# EAGLE design ewod-1x4 (EAGLE 6.3)

## Sheet 1 of 3
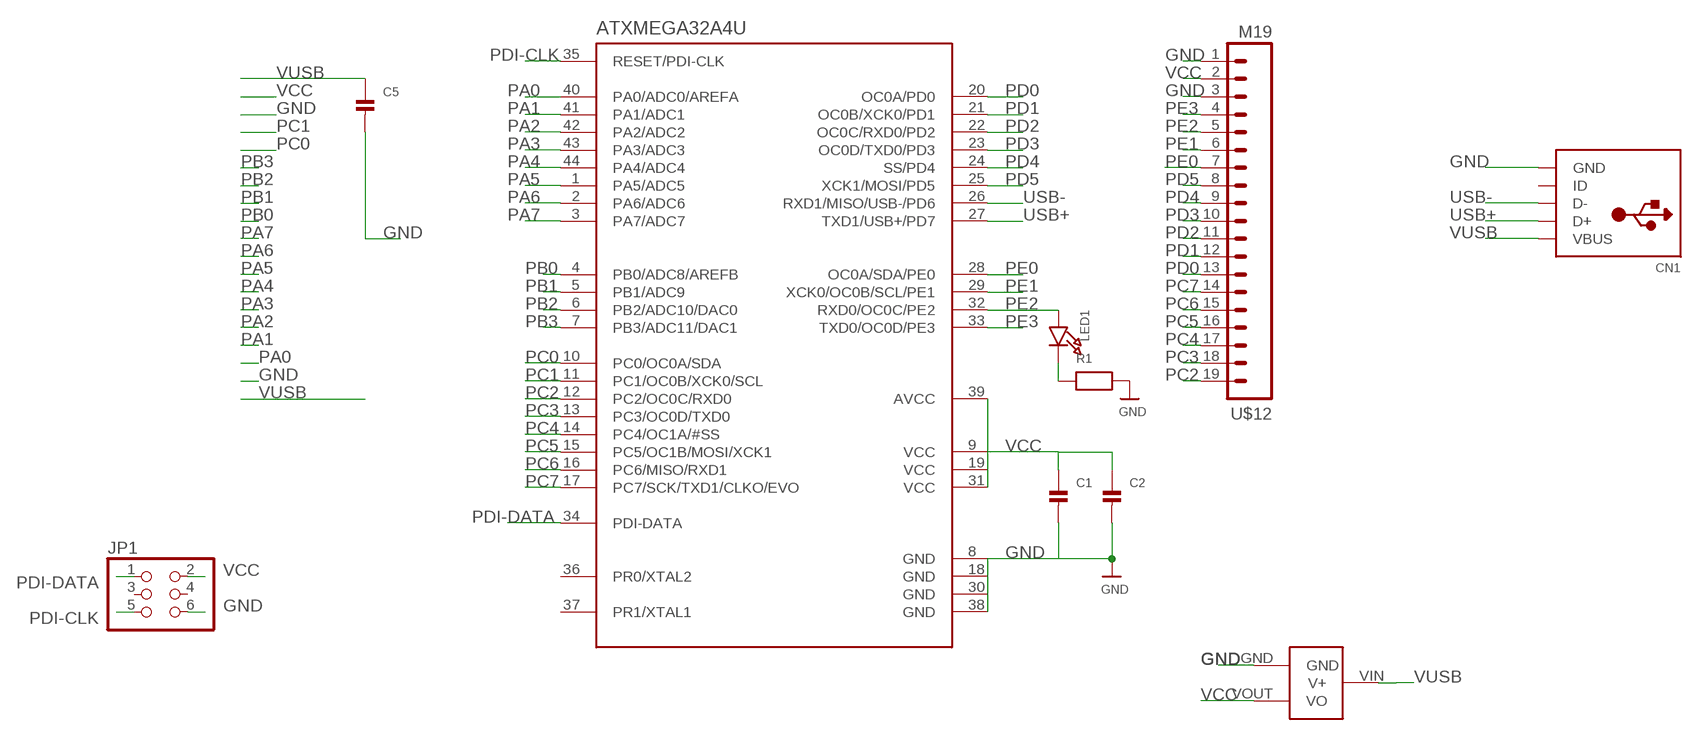
[diagram p0: schematic, sheet 1]

### Parts
ATXMEGA32A4U  ATXMEGAXXA4U-AU  [TQFP-44]
C1  CAP_CERAMIC0603  [0603]
C2  CAP_CERAMIC0603  [0603]
C5  CAP_CERAMIC0603  [0603]
CN1  USBMICROB  [USB-MICROB]
JP1  HEADER-2X3  [2X03]
LED1  LED0603  [CHIPLED_0603]
R1  RESISTOR0603  [0603]
U$10  MCP1700  [SOT23-3]
U$12  M19  [1X19]

### Nets
GND: ATXMEGA32A4U.8(GND) ATXMEGA32A4U.18(GND) ATXMEGA32A4U.30(GND) ATXMEGA32A4U.38(GND) C1.2 C2.2 C5.2 CN1.P5(GND) JP1.6 R1.2 U$10.GND U$12.1 U$12.3 ; also sheet 2,3
N$1: LED1.C R1.1
PA0: ATXMEGA32A4U.40(PA0/ADC0/AREFA) ; also sheet 2
PA1: ATXMEGA32A4U.41(PA1/ADC1) ; also sheet 2
PA2: ATXMEGA32A4U.42(PA2/ADC2) ; also sheet 2
PA3: ATXMEGA32A4U.43(PA3/ADC3) ; also sheet 2
PA4: ATXMEGA32A4U.44(PA4/ADC4)
PA5: ATXMEGA32A4U.1(PA5/ADC5)
PA6: ATXMEGA32A4U.2(PA6/ADC6)
PA7: ATXMEGA32A4U.3(PA7/ADC7)
PB0: ATXMEGA32A4U.4(PB0/ADC8/AREFB)
PB1: ATXMEGA32A4U.5(PB1/ADC9)
PB2: ATXMEGA32A4U.6(PB2/ADC10/DAC0)
PB3: ATXMEGA32A4U.7(PB3/ADC11/DAC1)
PC0: ATXMEGA32A4U.10(PC0/OC0A/SDA)
PC1: ATXMEGA32A4U.11(PC1/OC0B/XCK0/SCL)
PC2: ATXMEGA32A4U.12(PC2/OC0C/RXD0) U$12.19
PC3: ATXMEGA32A4U.13(PC3/OC0D/TXD0) U$12.18
PC4: ATXMEGA32A4U.14(PC4/OC1A/#SS) U$12.17 ; also sheet 2
PC5: ATXMEGA32A4U.15(PC5/OC1B/MOSI/XCK1) U$12.16 ; also sheet 2
PC6: ATXMEGA32A4U.16(PC6/MISO/RXD1) U$12.15 ; also sheet 2
PC7: ATXMEGA32A4U.17(PC7/SCK/TXD1/CLKO/EVO) U$12.14 ; also sheet 2
PD0: ATXMEGA32A4U.20(OC0A/PD0) U$12.13
PD1: ATXMEGA32A4U.21(OC0B/XCK0/PD1) U$12.12
PD2: ATXMEGA32A4U.22(OC0C/RXD0/PD2) U$12.11
PD3: ATXMEGA32A4U.23(OC0D/TXD0/PD3) U$12.10
PD4: ATXMEGA32A4U.24(SS/PD4) U$12.9
PD5: ATXMEGA32A4U.25(XCK1/MOSI/PD5) U$12.8
PDI-CLK: ATXMEGA32A4U.35(RESET/PDI-CLK) JP1.5
PDI-DATA: ATXMEGA32A4U.34(PDI-DATA) JP1.1
PE0: ATXMEGA32A4U.28(OC0A/SDA/PE0) U$12.7
PE1: ATXMEGA32A4U.29(XCK0/OC0B/SCL/PE1) U$12.6
PE2: ATXMEGA32A4U.32(RXD0/OC0C/PE2) LED1.A U$12.5
PE3: ATXMEGA32A4U.33(TXD0/OC0D/PE3) U$12.4
USB+: ATXMEGA32A4U.27(TXD1/USB+/PD7) CN1.P3(D+)
USB-: ATXMEGA32A4U.26(RXD1/MISO/USB-/PD6) CN1.P2(D-)
VCC: ATXMEGA32A4U.9(VCC) ATXMEGA32A4U.19(VCC) ATXMEGA32A4U.31(VCC) ATXMEGA32A4U.39(AVCC) C1.1 C2.1 JP1.2 U$10.VOUT(VO) U$12.2
VUSB: C5.1 CN1.P1(VBUS) U$10.VIN(V+)
Unconnected: ATXMEGA32A4U.36(PR0/XTAL2) ATXMEGA32A4U.37(PR1/XTAL1) CN1.P4(ID) JP1.3 JP1.4

## Sheet 2 of 3
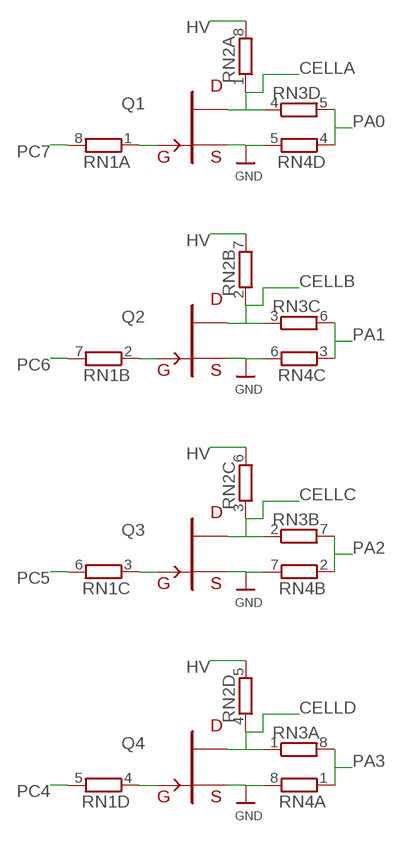
[diagram p1: schematic, sheet 2]

### Parts
Q1  FET-N  [SOT23]
Q2  FET-N  [SOT23]
Q3  FET-N  [SOT23]
Q4  FET-N  [SOT23]
RN1  RNETWORK  [RN8P-4R-CRA06S]
RN2  RNETWORK  [RN8P-4R-CRA06S]
RN3  RNETWORK  [RN8P-4R-CRA06S]
RN4  RNETWORK  [RN8P-4R-CRA06S]

### Nets
CELLA: Q1.3(D) RN2.1 RN3.4
CELLB: Q2.3(D) RN2.2 RN3.3
CELLC: Q3.3(D) RN2.3 RN3.2
CELLD: Q4.3(D) RN2.4 RN3.1
GATEA: Q1.1(G) RN1.1
GATEB: Q2.1(G) RN1.2
GATEC: Q3.1(G) RN1.3
GATED: Q4.1(G) RN1.4
GND: Q1.2(S) Q2.2(S) Q3.2(S) Q4.2(S) RN4.5 RN4.6 RN4.7 RN4.8 ; also sheet 1,3
HV: RN2.5 RN2.6 RN2.7 RN2.8 ; also sheet 3
PA0: RN3.5 RN4.4 ; also sheet 1
PA1: RN3.6 RN4.3 ; also sheet 1
PA2: RN3.7 RN4.2 ; also sheet 1
PA3: RN3.8 RN4.1 ; also sheet 1
PC4: RN1.5 ; also sheet 1
PC5: RN1.6 ; also sheet 1
PC6: RN1.7 ; also sheet 1
PC7: RN1.8 ; also sheet 1

## Sheet 3 of 3
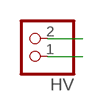
[diagram p2: schematic, sheet 3]

### Parts
HV  HEADER-1X2ROUND  [1X02_ROUND]

### Nets
GND: HV.2 ; also sheet 1,2
HV: HV.1 ; also sheet 2

## Library data of the parts
ATXMEGA32A4U = nonolith:ATXMEGAXXA4U: ATXMEGA A4U Series (XMEGA+USB)
C1 C2 C5 = nonolith:CAP_CERAMIC: Ceramic Capacitors 0402 - 0402 Surface Mount Capacitors 0.1uF 10V 10% [Digikey: 490-1318-2-ND] 0603 - 0603 Surface Mount Capacitors 16 pF 50V 5% [Digikey: 445-5051-2-ND] 22 pF 50V [Digikey: PCC220ACVTR-ND] 33 pF 50V 5% [Digikey: 490-1415-1-ND] 56pF 50V 5% [Digikey: 490-1421-1-ND] 220pF 50V 5% [Digikey: 445-1285-1-ND] 680 pF 50V 2200 pF 50V 5% C0G [Digikey: 445-1297-1-ND] 5600 pF 100V 5% X7R [Digikey: 478-3711-1-ND] 0.1 µF 25V 10% [Digikey: PCC2277TR-ND] 0.22 µF 16V 10% X7R [Digikey: 445-1318-1-ND] 1.0 µF 25V 10% [Digikey: 445-5146-2-ND] 0603 - RF Specific 3pF 250V +/-0.1pF RF [Digikey: 712-1347-1-ND] 18 pF 250V 5% [Digikey: 478-3505-1-ND or 712-1322-1-ND] 56 pF 250V 5% C0G RF [Digikey: 490-4867-1-ND] 68 pF 250V RF [Digikey: 490-4868-1-ND] 0805 - 0805 Surface Mount Capacitors 220 pF 250V 2% RF Ceramic Capacitor [Digikey: 712-1398-1-ND] 1000 pF 50V 2% NP0 Ceramic Capacitor [Digikey: 478-3760-1-ND] 0.1 µF 25V 10% Ceramic Capacitor [Digikey: PCC1828TR-ND] 1.0 µF 16V 10% Ceramic Capacitor[Digikey: 490-1691-2-ND] 10.0 µF 10V 10% Ceramic Capacitor[Digikey: 709-1228-1-ND] 1206 - 1206 Surface Mount Capacitors
CN1 = nonolith:USB: USB Connectors USBMINIB - Surface Mount Female Mini-B USB Connector 4UConnector: 06564 By microbuilder.eu
HV = nonolith:HEADER-1X2: PIN HEADER
JP1 = nonolith:HEADER-2X3: PIN HEADER
LED1 = microbuilder:LED: LED 0603 - 0603 Surface Mount Package 2mA: Green LED - Low Power (3.9mcd, 2ma, 1.7Vf) - Digikey: 475-2709-2-ND Orange LED - Low Power (9.8mcd, 2ma, 1.8Vf) - Digikey: 475-1194-2-ND Red LED - Low Power (5mcd, 2ma, 1.8Vf) - Digikey: 475-1195-2-ND Yellow LED - Low Power (7mcd, 2ma, 1.8Vf) - Digikey: 475-1196-2-ND 5mA: Blue LED - Low Power (17mcd, 5ma, 2.9Vf) - Digikey: LNJ937W8CRACT-ND 0805 - 0805 Surface Mount Package 2mA: Red LED (8.8mcd, 2mA, 1.8Vf, Clear) - Low Power [Digikey: 475-2510-1-ND] Green LED (5mcd, 2mA, 1.8Vf, Clear) - Low Power [Digikey: 475-2730-1-ND] Yellow LED (11.3mcd, 2mA, 1.8Vf, Clear) - Low Power [Digikey: 475-2555-1-ND] 20mA: Red LED (104mcd, 20mA, Diffused) - LS R976 [Digikey: 475-1278-6-ND] Red LED (12mcd, 20mA, 2.0Vf, Clear) - APT2012EC [Digikey: 754-1128-1-ND] Green LED (15mcd, 20mA, 2.2Vf, Clear) - APT2012GC [Digikey: 754-1131-1-ND] Orange LED (160mcd, 20mA, 2.1Vf, Clear) - APT2012SECK [Digikey: 754-1130-1-ND] 1206 - 1206 Surface Mount Package Green LED (26mcd, 20mA, Diffused) - LG N971 [Digikey: 475-1407-6-ND] Red LED (15mcd, 20mA, Diffused) - LH N974 [Digikey: 475-1416-6-ND]
Q1-Q4 = dp_devices:FET-N
R1 = nonolith:RESISTOR: Resistors 0402 - 0402 Surface Mount Package 10.0K 1% 1/16W [Digikey: 311-10.0KLRTR-ND] 0603 - 0603 Surface Mount Package 0 Ohm 1/10 Watt 1% Resistor 15 Ohm 1/10 Watt 1% Resistor 33 Ohm 1/10 Watt 1% Resistor 49.9 Ohm 1/10 Watt 1% Resistor 100 Ohm 1/10 Watt 1% Resistor 150 Ohm 1/10 Watt 1% Resistor 240 Ohm 1/10 Watt 1% Resistor 390 Ohm 1/10 Watt 1% Resistor 560 Ohm 1/10 Watt 1% Resistor 750 Ohm 1/10 Watt 1% Resistor 1.0K Ohm 1/10 Watt 1% Resistor 1.5K Ohm 1/10 Watt 1% Resistor 2.0K Ohm 1/10 Watt 1% Resistor 4.7K Ohm 1/10 Watt 1% Resistor 10.0K Ohm 1/10 Watt 1% Resistor 20.0K Ohm 1/10 Watt 1% Resistor 33.0K Ohm 1/10 Watt 1% Resistor 100.0K Ohm 1/10 Watt 1% Resistor 0805 - 0805 Surface Mount Package 0 Ohm 1/8 Watt 1% Resistor 33 Ohm 1/8 Watt 1% Resistor 100 Ohm 1/8 Watt 1% Resistor 150 Ohm 1/8 Watt 1% Resistor 200 Ohm 1/8 Watt 1% Resistor 240 Ohm 1/8 Watt 1% Resistor 330 Ohm 1/8 Watt 1% Resistor 390 Ohm 1/8 Watt 1% Resistor 470 Ohm 1/8 Watt 1% Resistor 1.0K Ohm 1/8 Watt 1% Resistor 1.5K Ohm 1/8 Watt 1% Resistor 2.0K Ohm 1/8 Watt 1% Resistor 4.7K Ohm 1/8 Watt 1% Resistor 5.1K Ohm 1/8 Watt 1% Resistor 5.6K Ohm 1/8 Watt 1% Resistor 10.0K Ohm 1/8 Watt 1% Resistor 22.0K Ohm 1/8 Watt 1% Resistor 33.0K Ohm 1/8 Watt 1% Resistor 100K Ohm 1/8 Watt 1% Resistor 1206 - 1206 Surface Mount Package
RN1-RN4 = nonolith:RNETWORK: 4 Resistor Array 0603
U$10 = nonolith:MCP1700: Voltage regulator
U$12 = SparkFun:M19

## Net classes
0 default: width 0.203 mm, clearance 0.152 mm

## Board
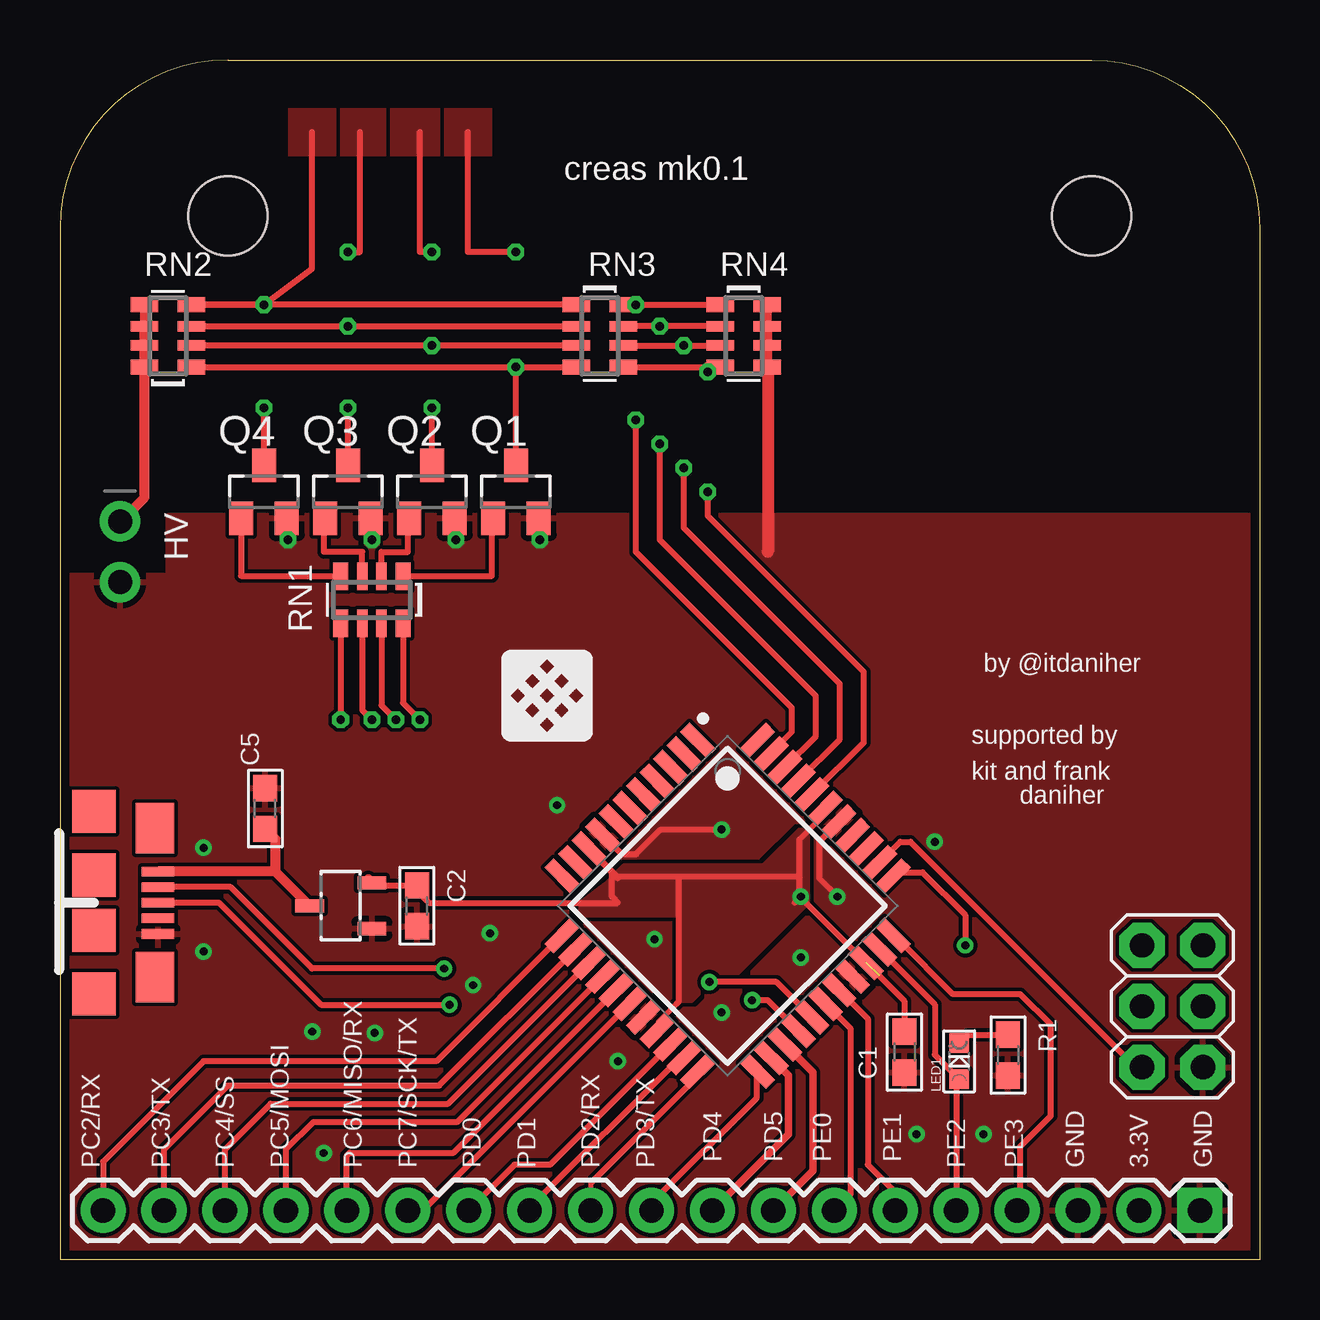
[diagram p3: board, top side]
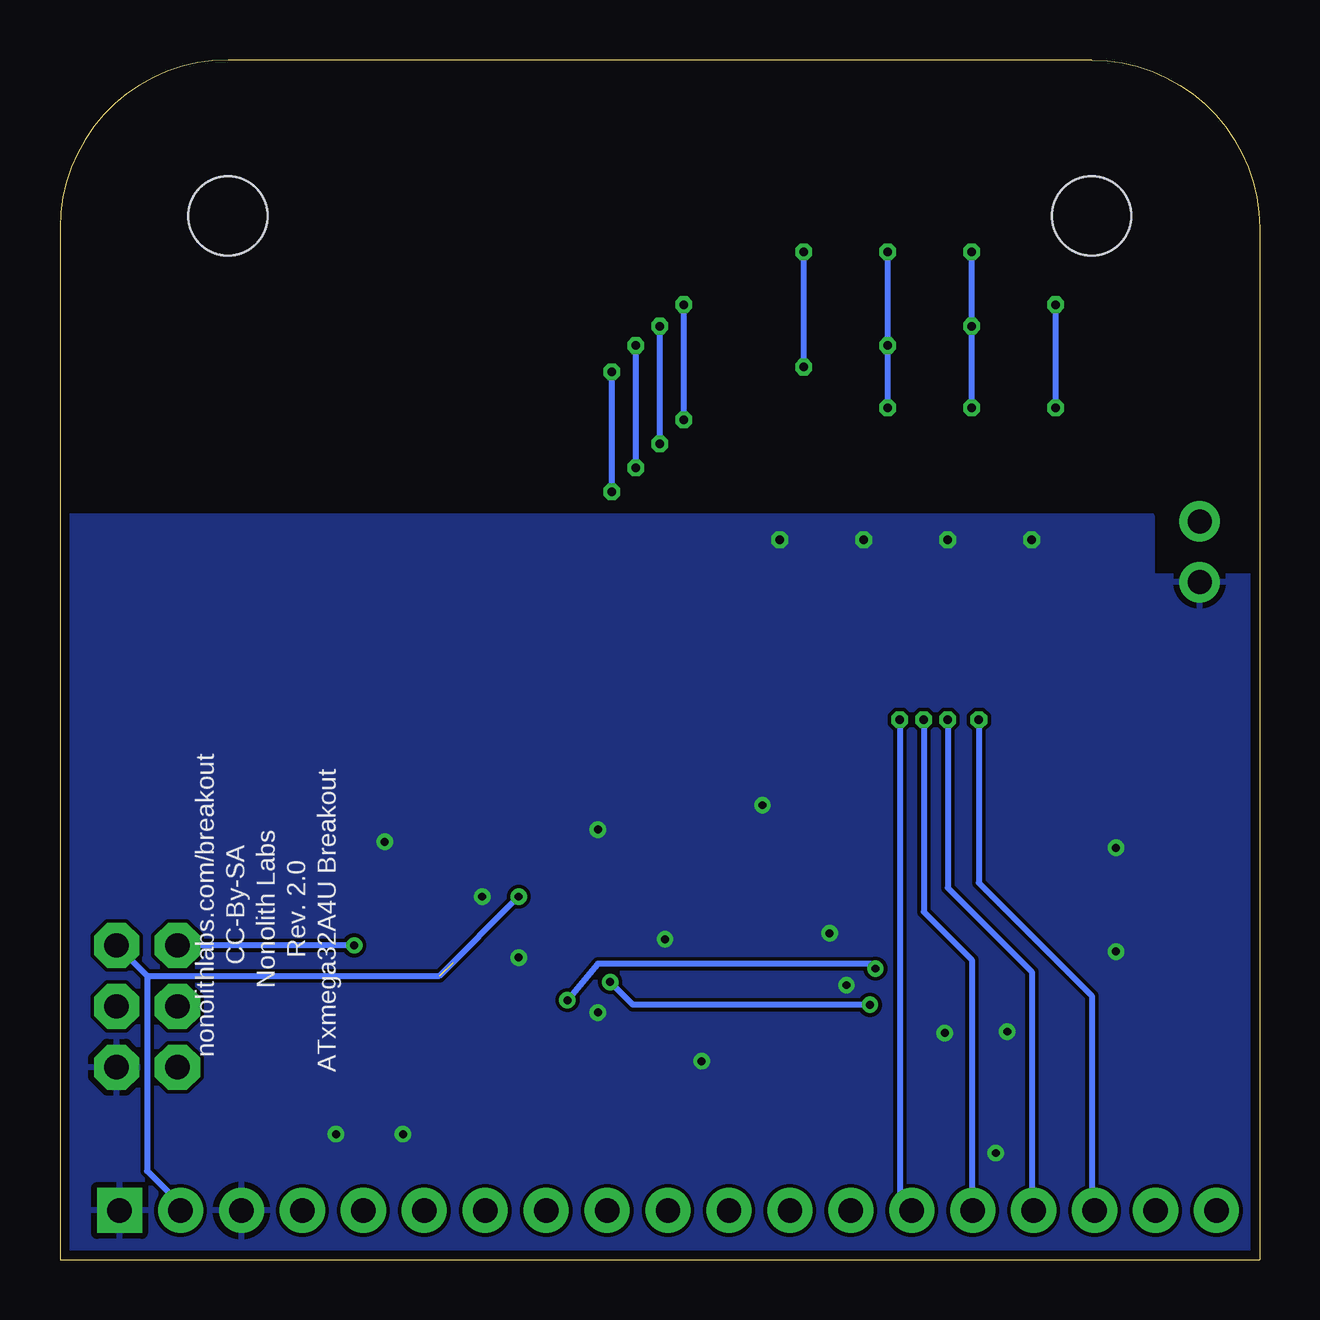
[diagram p4: board, bottom side, seen from below]

Size 50 x 50 mm. Coordinates in mm from the lower left corner, seen from the top.
Outline: 7,50 43,50 arc-90 50,43 50,0 0,0 0,43 arc-90 7,50
Copper layers (1*16): Top 0.0356mm / dielectric 1.5011mm / Bottom 0.0356mm
Design rules "LaenPCBOrder *": minimum track width 6mil, minimum drill 13mil, track to track 6mil, track to pad 6mil, pad to pad 6mil, via to via 6mil, smd to smd 6mil, copper to edge 15mil, drill to drill 6mil, minimum pad ring 7mil, minimum via ring 7mil, stop-mask expansion 0mil, vias tented up to drill 100mil, thermal gap 10mil
vRestrict: area 9,46 to 18.5,48.5

### Footprints (pad centres in the part's own frame; a part is rotated, then mirrored left to right if it is on the bottom)
TQFP-44 = smd 1.55 x 0.55: 1 -5.75,4; 2 -5.75,3.2; 3 -5.75,2.4; 4 -5.75,1.6; 5 -5.75,0.8; 6 -5.75,0; 7 -5.75,-0.8; 8 -5.75,-1.6; 9 -5.75,-2.4; 10 -5.75,-3.2; 11 -5.75,-4; 23 5.75,-4; 24 5.75,-3.2; 25 5.75,-2.4; 26 5.75,-1.6; 27 5.75,-0.8; 28 5.75,0; 29 5.75,0.8; 30 5.75,1.6; 31 5.75,2.4; 32 5.75,3.2; 33 5.75,4 | smd 0.55 x 1.55: 12 -4,-5.75; 13 -3.2,-5.75; 14 -2.4,-5.75; 15 -1.6,-5.75; 16 -0.8,-5.75; 17 0,-5.75; 18 0.8,-5.75; 19 1.6,-5.75; 20 2.4,-5.75; 21 3.2,-5.75; 22 4,-5.75; 34 4,5.75; 35 3.2,5.75; 36 2.4,5.75; 37 1.6,5.75; 38 0.8,5.75; 39 0,5.75; 40 -0.8,5.75; 41 -1.6,5.75; 42 -2.4,5.75; 43 -3.2,5.75; 44 -4,5.75
0603 = smd 1.1 x 1: 1 -0.85,0; 2 0.85,0
USB-MICROB = smd 0.4 x 1.35: P1 -1.3,2.675; P2 -0.65,2.675; P3 0,2.675; P4 0.65,2.675; P5 1.3,2.675 | smd 1.8 x 1.8: PAD-LB -1.15,0; PAD-LLB -3.8,0; PAD-RB 1.15,0; PAD-RRB 3.8,0 | smd 2.1 x 1.6: PAD-LT -3.1,2.55; PAD-RT 3.1,2.55
1X02_ROUND = drill 1 pad 1.676: 1 -1.27,0; 2 1.27,0
2X03 = drill 1.016 pad 1.88 octagon: 1 -2.54,-1.27; 2 -2.54,1.27; 3 0,-1.27; 4 0,1.27; 5 2.54,-1.27; 6 2.54,1.27
CHIPLED_0603 = smd 0.8 x 0.8: A 0,-0.75; C 0,0.75
SOT23 = smd 1 x 1.4: 1 -0.95,-1.1; 2 0.95,-1.1; 3 0,1.1
RN8P-4R-CRA06S = smd 0.63 x 1.15: 1 -1.295,-0.975; 4 1.295,-0.975; 5 1.295,0.975; 8 -1.295,0.975 | smd 0.44 x 1.15: 2 -0.4,-0.975; 3 0.4,-0.975; 6 0.4,0.975; 7 -0.4,0.975
STAND-OFF = hole 3.302: 0,0
SOT23-3 = smd 0.55 x 1.2: GND 0.95,1.3; VIN 0,-1.3; VOUT -0.95,1.3
1X19 = drill 1.016 pad 1.88 square: 1 0,0 | drill 1.016 pad 1.88: 2 2.54,0; 3 5.08,0; 4 7.62,0; 5 10.16,0; 6 12.7,0; 7 15.24,0; 8 17.78,0; 9 20.32,0; 10 22.86,0; 11 25.4,0; 12 27.94,0; 13 30.48,0; 14 33.02,0; 15 35.56,0; 16 38.1,0; 17 40.64,0; 18 43.18,0; 19 45.72,0

### Placement (x,y rotation side)
ATXMEGA32A4U  27.83,14.74 315 top
C1  35.2,8.65 270 top
C2  14.88,14.74 270 top
C5  8.56,18.8 90 top
CN1  1.41,14.87 270 top
HV  2.5,29.5 270 top
JP1  46.37,10.55 270 top
LED1  37.48,8.27 0 top
Q1  19,32 0 top
Q2  15.5,32 0 top
Q3  12,32 0 top
Q4  8.5,32 0 top
R1  39.51,8.52 270 top
RN1  13,27.5 180 top
RN2  4.5,38.5 90 top
RN3  22.5,38.5 270 top
RN4  28.5,38.5 270 top
U$1  [STAND-OFF]  7,43.5 0 top
U$2  [STAND-OFF]  43,43.5 0 top
U$5  [LOGO_NONOLITH]  18.4,21.6 0 top
U$10  11.7,14.74 270 top
U$12  47.52,2.04 180 top

### Tracks (layer width: path | path; a pad name or v marks a point on that pad's centre or on a via)
CELLA  (via drill 0.35)
  Top 0.254: RN2.1 v19,37.2 | v19,37.2 RN3.4 | Q1.3 v19,37.2 | v19,42 17,42 17,47
  Bottom 0.254: v19,37.2 v19,42
  pour Top (isolate 0.152, no thermals): 16,48 18,48 18,46 16,46
CELLB  (via drill 0.35)
  Top 0.254: RN3.3 v15.5,38.1 RN2.2 | Q2.3 v15.5,35.5 | v15.5,42 15,42 15,47
  Bottom 0.254: v15.5,35.5 v15.5,38.1 v15.5,42
  pour Top (isolate 0.152, rank 2, no thermals): 13.75,48 16,48 16,46 13.75,46
CELLC  (via drill 0.35)
  Top 0.254: RN2.3 v12,38.9 RN3.2 | Q3.3 v12,35.5 | v12,42 12.5,42 12.5,47
  Bottom 0.254: v12,35.5 v12,38.9 v12,42
  pour Top (isolate 0.152, rank 3, no thermals): 11.5,48 13.75,48 13.75,46 11.5,46
CELLD  (via drill 0.35)
  Top 0.254: RN3.1 RN2.4 v8.5,39.8 10.5,41.3 10.5,47 | Q4.3 v8.5,35.5
  Bottom 0.254: v8.5,35.5 v8.5,39.8
  pour Top (isolate 0.152, no thermals): 9.5,48 11.5,48 11.5,46 9.5,46
GATEA
  Top 0.254: 14.29,28.5 18,28.5 18,30.9
  Top 0.406: RN1.1 14.29,28.5 | 18,30.9 Q1.1
GATEB
  Top 0.254: RN1.2 13.4,29.5 14.5,29.5 14.5,30.9
  Top 0.406: 14.5,30.9 Q2.1
GATEC
  Top 0.254: RN1.3 12.6,29.5 11,29.5 11,30.9
  Top 0.406: 11,30.9 Q3.1
GATED
  Top 0.254: Q4.1 7.55,28.5 11.71,28.5
  Top 0.406: RN1.4 11.71,28.5
GND  (via drill 0.33, 0.35)
  Top 0.254: ATXMEGA32A4U.8 23.41,16.9 24.02,16.9 25.04,17.92 v27.58,17.92 | 32.4,18.17 31.64,17.41 31.64,15.89 v32.4,15.13
  Top 0.406: RN4.8 RN4.7 RN4.6 RN4.5
  Top 0.508: RN4.5 29.5,37.18 29.5,29.5
  other vias: 9.5,30 20,30 10.51,9.5 30.88,12.59 13.12,9.44 5.99,12.84 23.26,8.27 27.58,10.3 38.5,5.22 5.99,17.16 36.47,17.41 11,4.44 20.72,18.94 24.78,13.35 17.92,13.6 35.7,5.22 17.22,11.44 16.5,30 13,30
  pour Top (rank 6): -1,-0.5 52,-0.5 50,31 4.5,31 4.5,28.5 0,28.5
  pour Bottom: -4,-2 50,0.5 51,31 4.5,31 4.5,28.5 -4.5,28.5
HV
  Top 0.254: RN2.6 RN2.7 RN2.8
  Top 0.406: RN2.5 RN2.6 3.52,31.77 HV.1
N$1
  Top 0.254: LED1.C 37.84,9.37 R1.1
PA0  (via drill 0.35)
  Top 0.254: RN3.5 27,37.2 RN4.4 27.52,37.23 27.5,37.25 27.5,37 | ATXMEGA32A4U.40 33.5,21.55 33.5,24.5 27,31 v27,32
  Top 0.406: v27,37 27,37.2
  Bottom 0.254: v27,32 v27,37
PA1  (via drill 0.35)
  Top 0.254: RN3.6 v26,38.1 RN4.3 | ATXMEGA32A4U.41 32.5,21.68 32.5,24 26,30.5 v26,33
  Bottom 0.254: v26,33 v26,38.1
PA2  (via drill 0.35)
  Top 0.254: RN4.2 v25,38.9 RN3.7 | ATXMEGA32A4U.42 31.5,21.81 31.5,23.5 25,30 v25,34
  Bottom 0.254: v25,34 v25,38.9
PA3  (via drill 0.35)
  Top 0.254: RN3.8 v24,39.8 RN4.1 | ATXMEGA32A4U.43 29.63,21.13 30.5,22 30.5,23 24,29.5 v24,35
  Bottom 0.254: v24,35 v24,39.8
PC2
  Top 0.254: ATXMEGA32A4U.12 15.7,8.27 5.99,8.27 1.79,4.08 U$12.19
PC3
  Top 0.254: U$12.18 4.33,4.58 7,7.25 15.81,7.25 ATXMEGA32A4U.13
PC4  (via drill 0.35)
  Top 0.254: U$12.17 6.88,4.58 8.78,6.49 16.18,6.49 ATXMEGA32A4U.14 | RN1.5 v11.7,22.5
  Bottom 0.254: v11.7,22.5 11.7,15.7 7,11 7,2.17 U$12.17
PC5  (via drill 0.35)
  Top 0.254: ATXMEGA32A4U.15 16.55,5.73 10.56,5.73 9.41,4.58 U$12.16 | RN1.6 12.6,22.9 v13,22.5
  Bottom 0.254: v13,22.5 13,15.5 9.5,12 9.5,2.13 U$12.16
PC6  (via drill 0.35)
  Top 0.254: U$12.15 11.96,4.33 12.08,4.46 16.41,4.46 ATXMEGA32A4U.16 | RN1.7 13.4,23.1 v14,22.5
  Bottom 0.254: v14,22.5 14,14.5 12,12.5 12,2.09 U$12.15
PC7  (via drill 0.35)
  Top 0.254: ATXMEGA32A4U.17 15.13,2.04 U$12.14 | RN1.8 14.29,23.2 v15,22.5
  Bottom 0.254: v15,22.5 15,2.55 U$12.14
PD0
  Top 0.254: ATXMEGA32A4U.20 20.43,3.95 18.94,3.95 U$12.13
PD1
  Top 0.203: 25.8,8.37 26,8.37 ATXMEGA32A4U.21 | 19.6,2.17 19.6,2.07 U$12.12
  Top 0.254: 19.6,2.17 25.8,8.37
PD2
  Top 0.203: 26.56,7.61 26.56,7.81 ATXMEGA32A4U.22 | 22.14,3.19 22.14,2.07 U$12.11
  Top 0.254: 22.14,3.19 26.56,7.61
PD3
  Top 0.203: 24.68,2.38 24.68,2.07 U$12.10 | 29.05,7.81 ATXMEGA32A4U.23
  Top 0.254: 29.05,7.81 29.05,6.74 24.68,2.38
PD4
  Top 0.305: ATXMEGA32A4U.24 30.37,7.68 30.37,5.22 U$12.9
PD5
  Top 0.305: U$12.8 31.39,3.7 31.39,7.79 ATXMEGA32A4U.25
PDI-CLK
  Top 0.254: ATXMEGA32A4U.35 35.02,17.41 35.45,17.41 44.85,8.01 JP1.5
PDI-DATA  (via drill 0.33)
  Top 0.254: ATXMEGA32A4U.34 34.88,16.14 35.96,16.14 37.74,14.36 v37.74,13.09
  Bottom 0.254: v37.74,13.09 JP1.1
PE0
  Top 0.203: 31.95,10.66 ATXMEGA32A4U.28
  Top 0.254: U$12.7 32.96,2.73 32.96,9.61 ATXMEGA32A4U.28
PE1
  Top 0.254: ATXMEGA32A4U.29 33.67,10.03 33.67,3.95 34.81,2.81 U$12.6
PE2
  Top 0.254: ATXMEGA32A4U.32 36.47,10.63 36.47,8.53 LED1.A 37.35,7.64 U$12.5
PE3
  Top 0.254: U$12.4 40.02,2.17 40.02,4.71 41.29,5.98 41.29,9.79 40.02,11.06 37.23,11.06 34.94,13.35 34.69,13.35 34.72,13.38 ATXMEGA32A4U.33 34.78,13.51
USB+  (via drill 0.33)
  Top 0.254: ATXMEGA32A4U.27 29.87,11.57 v27.07,11.57 | CN1.P3 6.63,14.87 10.88,10.62 v16.24,10.62
  Bottom 0.254: v16.24,10.62 26.12,10.62 v27.07,11.57
USB-  (via drill 0.33)
  Top 0.254: ATXMEGA32A4U.26 29.5,10.81 v28.85,10.81 | CN1.P2 7.11,15.52 10.51,12.13 v16.01,12.13
  Bottom 0.254: v28.85,10.81 27.58,12.33 16.22,12.33 v16.01,12.13
VCC  (via drill 0.33)  (1 unrouted)
  Top 0.203: 30.83,17.51 31.89,18.58 31.89,18.78 ATXMEGA32A4U.39 | 14.62,15.63 14.57,15.69 | 25.7,10.66 24.93,9.89 24.93,9.59 ATXMEGA32A4U.19
  Top 0.254: 30.83,15.94 30.83,15.14 35.2,10.77 C1.1 35.2,9.28 | 30.83,15.94 30.83,17.51 | 30.83,15.94 25.8,15.94 | 25.8,15.94 23.21,15.94 | 25.7,10.66 25.8,10.76 25.8,15.94 | ATXMEGA32A4U.9 23.26,15.92 23.26,15.89 | 14.62,15.63 14.75,15.51 | 14.75,15.51 15.38,14.87 23.26,14.87 23,15.13 23,16.14 21.99,17.16 | U$10.VOUT 13.1,15.6 C2.1 14.79,15.51 14.75,15.51 | v30.88,15.13 30.62,14.87
  Top 0.406: U$10.VOUT 12.84,15.85
  Bottom 0.254: JP1.2 46.37,11.82 | 46.37,11.82 46.37,3.7 44.98,2.3 U$12.2 | 46.37,11.82 34.18,11.82 v30.88,15.13
  pour Top: 21.73,14.87 22.75,15.63 23.51,16.4 29.35,16.4 30.88,17.92 31.13,17.67 31.13,14.87 28.08,11.82 27.32,11.82 26.31,10.81 25.8,10.81 25.8,14.36 21.73,14.36
VUSB
  Top 0.254: CN1.P1 6.78,16.17
  Top 0.406: U$10.VIN 8.97,16.17 | 8.97,16.17 CN1.P1 | C5.1 8.97,17.53 8.97,16.17

### Text on the board
tNames: creas mk0.1 | by @itdaniher | supported by | kit and frank | daniher | PC2/RX | PC3/TX | PC4/SS | PC5/MOSI | PC6/MISO/RX | PC7/SCK/TX | PD0 | PD1 | PD2/RX | PD3/TX | PD4 | PD5 | PE0 | PE1 | PE2 | PE3 | GND | 3.3V | GND
bNames: nonolithlabs.com/breakout | ATxmega32A4U Breakout | Nonolith Labs | Rev. 2.0 | CC-By-SA